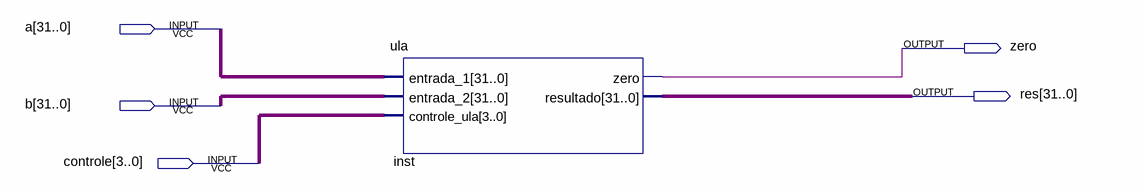
[diagram p0: schematic sheet]
// Quartus schematic teste_ula.bdf as structural Verilog: 1 symbols, 5 pins
module teste_ula (
  input  [31:0] a,
  input  [31:0] b,
  input  [3:0] controle,
  output zero,
  output [31:0] res
);

  ula inst (.entrada_1(a), .entrada_2(b), .controle_ula(controle), .zero(zero), .resultado(res));
endmodule
